# EAGLE schematic LEDtestBoard (EAGLE 6.4)
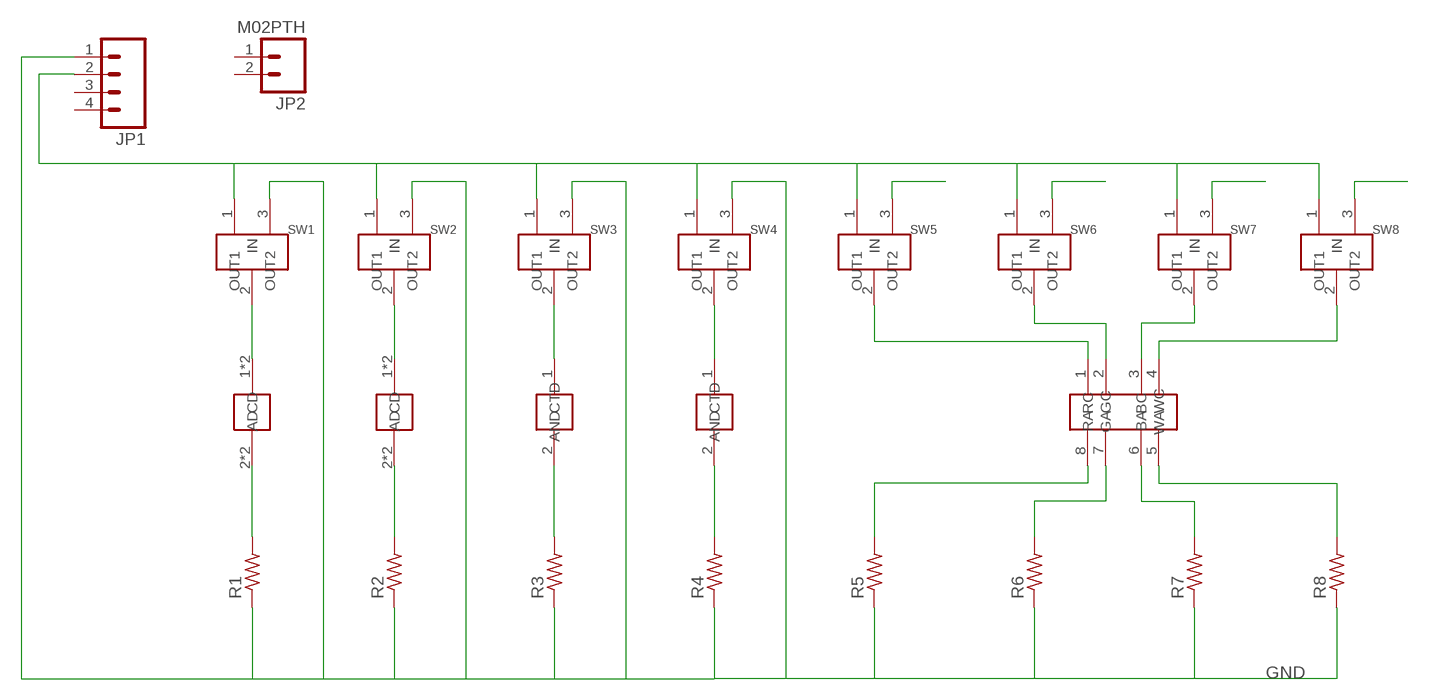
[diagram p0: schematic, sheet 1]

## Parts
D1  SZA05A0A  [SZA05A0A]
D2  SZA05A0A  [SZA05A0A]
D3  XLAMP_COLOR  [8-SMD-LED]
D4  LACN5MFBGB241Z  [2-SMD-LED-NO-EXP]
D5  LACN5MFBGB241Z  [2-SMD-LED-NO-EXP]
JP1  M04PTH  [1X04]
JP2  M02PTH  [1X02]
R1  R-US_R0603  [R0603]
R2  R-US_R0603  [R0603]
R3  R-US_R0603  [R0603]
R4  R-US_R0603  [R0603]
R5  R-US_R0603  [R0603]
R6  R-US_R0603  [R0603]
R7  R-US_R0603  [R0603]
R8  R-US_R0603  [R0603]
SW1  PCM12SMTR  [PCM12SMTR]
SW2  PCM12SMTR  [PCM12SMTR]
SW3  PCM12SMTR  [PCM12SMTR]
SW4  PCM12SMTR  [PCM12SMTR]
SW5  PCM12SMTR  [PCM12SMTR]
SW6  PCM12SMTR  [PCM12SMTR]
SW7  PCM12SMTR  [PCM12SMTR]
SW8  PCM12SMTR  [PCM12SMTR]

## Nets
GND: JP1.1 R1.1 R2.1 R3.1 R4.1 R5.1 R6.1 R7.1 R8.1 SW1.3(OUT2) SW2.3(OUT2) SW3.3(OUT2) SW4.3(OUT2) SW5.3(OUT2) SW6.3(OUT2) SW7.3(OUT2) SW8.3(OUT2)
N$1: JP1.2 SW1.1(OUT1) SW2.1(OUT1) SW3.1(OUT1) SW4.1(OUT1) SW5.1(OUT1) SW6.1(OUT1) SW7.1(OUT1) SW8.1(OUT1)
N$2: D1.2(CD) D1.12(CD) R1.2
N$3: D1.1(AD) D1.11(AD) SW1.2(IN)
N$4: D2.1(AD) D2.11(AD) SW2.2(IN)
N$5: D2.2(CD) D2.12(CD) R2.2
N$7: D4.2(CTD) R3.2
N$8: D4.1(AND) SW3.2(IN)
N$9: D5.1(AND) SW4.2(IN)
N$10: D5.2(CTD) R4.2
N$13: D3.1(RA) SW5.2(IN)
N$14: D3.2(GA) SW6.2(IN)
N$15: D3.3(BA) SW7.2(IN)
N$16: D3.4(WA) SW8.2(IN)
N$17: D3.8(RC) R5.2
N$18: D3.7(GC) R6.2
N$19: D3.6(BC) R7.2
N$20: D3.5(WC) R8.2
Unconnected: JP1.3 JP1.4 JP2.1 JP2.2

## Library data of the parts
D1 D2 = freddyLibr:SZA05A0A: 2 pin SMD LED from Seoul Semiconductors.
D3 = freddyLibr:XLAMP_COLOR: 8 pin 4 color LED from XLAMP
D4 D5 = freddyLibr:LACN5MFBGB241Z: 2 pin SMD LED from Osram Opto Semiconductors
JP1 = SparkFun-Connectors:M04: Header 4 Standard 4-pin 0.1" header. Use with straight break away headers (SKU : PRT-00116), right angle break away headers (PRT-00553), swiss pins (PRT-00743), machine pins (PRT-00117), and female headers (PRT-00115). Molex polarized connector foot print use with SKU : PRT-08231 with associated crimp pins and housings. 1MM SMD Version SKU: PRT-10208
JP2 = SparkFun-Connectors:M02: Standard 2-pin 0.1" header. Use with - straight break away headers ( PRT-00116) - right angle break away headers (PRT-00553) - swiss pins (PRT-00743) - machine pins (PRT-00117) - female headers (PRT-00115) Molex polarized connector foot print use with: PRT-08233 with associated crimp pins and housings. 2.54_SCREWTERM for use with PRT-10571. 3.5mm Screw Terminal footprints for PRT-08084 5mm Screw Terminal footprints for use with PRT-08433
R1-R8 = resistor:R-US_: RESISTOR, American symbol
SW1-SW8 = freddyLibr:PCM12SMTR: Three pin switch. Horizontal gull wing surface mount.